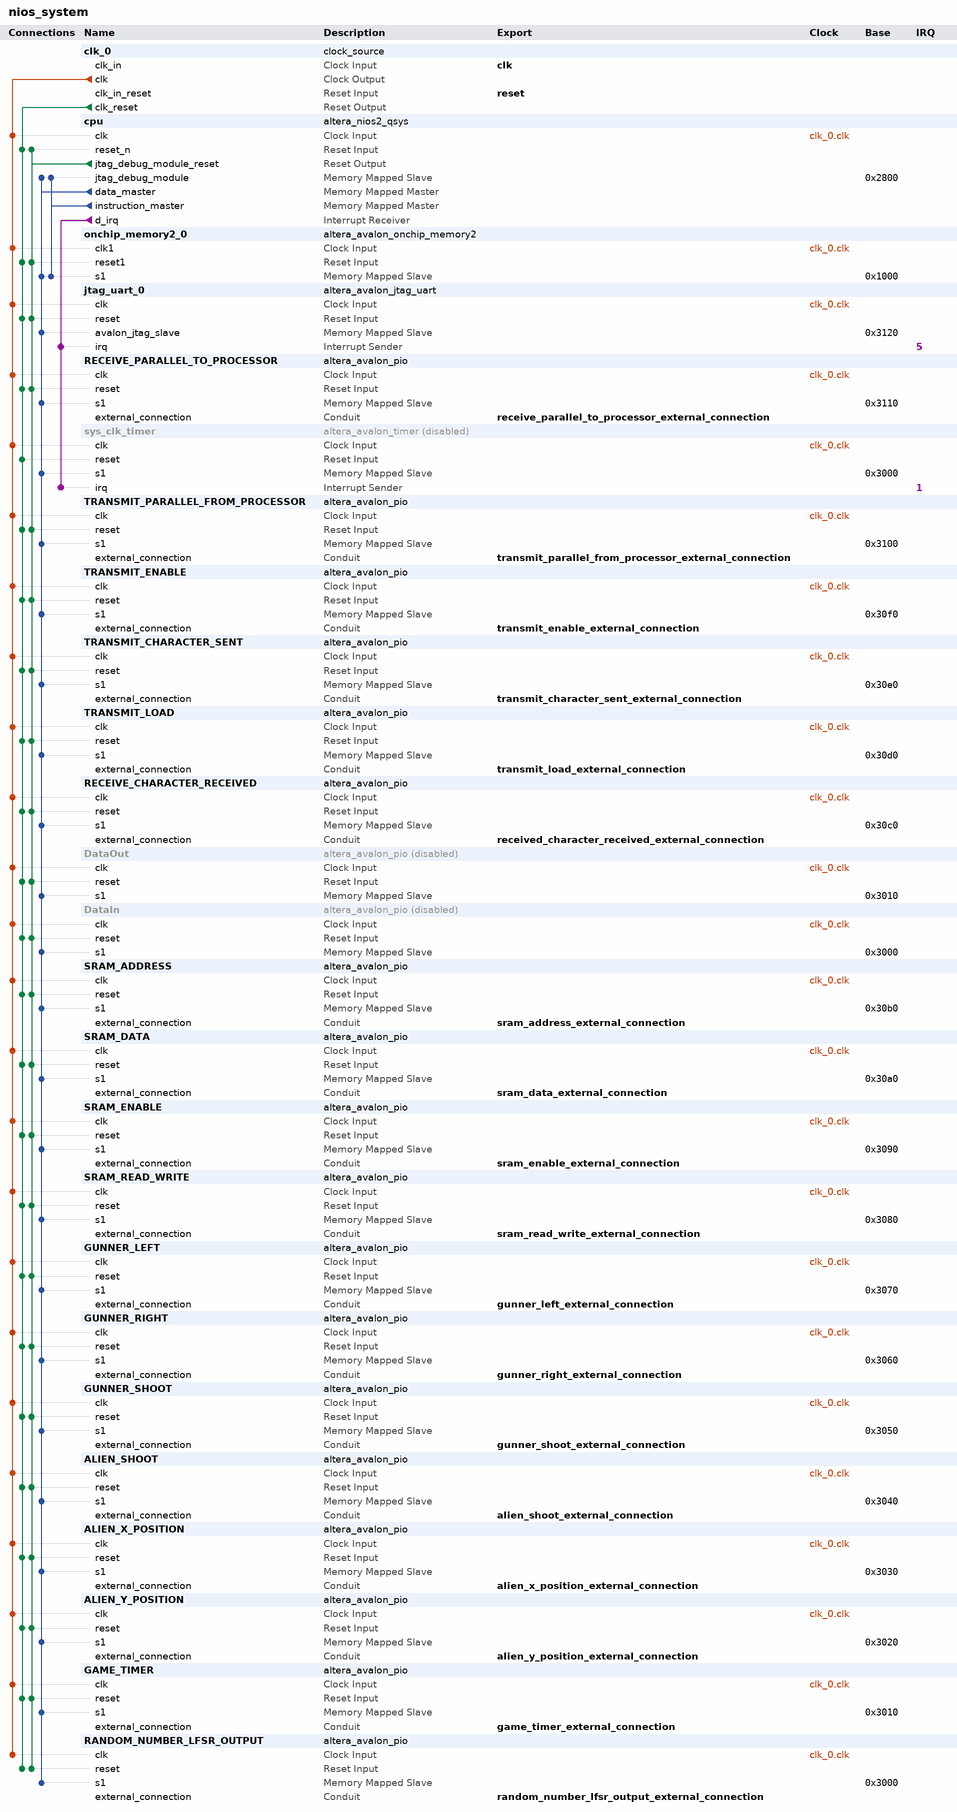
[diagram p0: system contents]
# Platform Designer (Qsys) system nios_system, Cyclone V 5CSEMA5F31C6
# Parameters at their usual value, and those the tool derives, are not listed.
package require -exact qsys 14.0
create_system nios_system
set_project_property DEVICE_FAMILY {Cyclone V}
set_project_property DEVICE 5CSEMA5F31C6

add_instance clk_0 clock_source 14.0
set_instance_parameter_value clk_0 clockFrequency 50000000

add_instance cpu altera_nios2_qsys 14.0
set_instance_parameter_value cpu resetrequest_enabled true
set_instance_parameter_value cpu resetSlave onchip_memory2_0.s1
set_instance_parameter_value cpu mmu_TLBMissExcSlave None
set_instance_parameter_value cpu exceptionSlave onchip_memory2_0.s1
set_instance_parameter_value cpu breakSlave cpu.jtag_debug_module
set_instance_parameter_value cpu impl Tiny
set_instance_parameter_value cpu icache_size 4096

add_instance onchip_memory2_0 altera_avalon_onchip_memory2 14.0
set_instance_parameter_value onchip_memory2_0 dataWidth 32
set_instance_parameter_value onchip_memory2_0 dualPort false
set_instance_parameter_value onchip_memory2_0 initMemContent true
set_instance_parameter_value onchip_memory2_0 initializationFileName onchip_mem.hex
set_instance_parameter_value onchip_memory2_0 memorySize 4096

add_instance jtag_uart_0 altera_avalon_jtag_uart 14.0
set_instance_parameter_value jtag_uart_0 simInteractiveOptions NO_INTERACTIVE_WINDOWS

add_instance RECEIVE_PARALLEL_TO_PROCESSOR altera_avalon_pio 14.0
set_instance_parameter_value RECEIVE_PARALLEL_TO_PROCESSOR direction Input
set_instance_parameter_value RECEIVE_PARALLEL_TO_PROCESSOR width 8

add_instance sys_clk_timer altera_avalon_timer 14.0
set_instance_property sys_clk_timer ENABLED false
set_instance_parameter_value sys_clk_timer period 1
set_instance_parameter_value sys_clk_timer periodUnits MSEC

add_instance TRANSMIT_PARALLEL_FROM_PROCESSOR altera_avalon_pio 14.0
set_instance_parameter_value TRANSMIT_PARALLEL_FROM_PROCESSOR direction Output
set_instance_parameter_value TRANSMIT_PARALLEL_FROM_PROCESSOR width 8

add_instance TRANSMIT_ENABLE altera_avalon_pio 14.0
set_instance_parameter_value TRANSMIT_ENABLE direction Output
set_instance_parameter_value TRANSMIT_ENABLE width 1

add_instance TRANSMIT_CHARACTER_SENT altera_avalon_pio 14.0
set_instance_parameter_value TRANSMIT_CHARACTER_SENT direction Input
set_instance_parameter_value TRANSMIT_CHARACTER_SENT width 1

add_instance TRANSMIT_LOAD altera_avalon_pio 14.0
set_instance_parameter_value TRANSMIT_LOAD direction Output
set_instance_parameter_value TRANSMIT_LOAD width 1

add_instance RECEIVE_CHARACTER_RECEIVED altera_avalon_pio 14.0
set_instance_parameter_value RECEIVE_CHARACTER_RECEIVED direction Input
set_instance_parameter_value RECEIVE_CHARACTER_RECEIVED width 1

add_instance DataOut altera_avalon_pio 14.0
set_instance_property DataOut ENABLED false
set_instance_parameter_value DataOut direction Output
set_instance_parameter_value DataOut width 1

add_instance DataIn altera_avalon_pio 14.0
set_instance_property DataIn ENABLED false
set_instance_parameter_value DataIn direction Input
set_instance_parameter_value DataIn width 1

add_instance SRAM_ADDRESS altera_avalon_pio 14.0
set_instance_parameter_value SRAM_ADDRESS direction Output
set_instance_parameter_value SRAM_ADDRESS width 11

add_instance SRAM_DATA altera_avalon_pio 14.0
set_instance_parameter_value SRAM_DATA direction Bidir
set_instance_parameter_value SRAM_DATA width 8

add_instance SRAM_ENABLE altera_avalon_pio 14.0
set_instance_parameter_value SRAM_ENABLE direction Output
set_instance_parameter_value SRAM_ENABLE width 1

add_instance SRAM_READ_WRITE altera_avalon_pio 14.0
set_instance_parameter_value SRAM_READ_WRITE direction Output
set_instance_parameter_value SRAM_READ_WRITE width 1

add_instance GUNNER_LEFT altera_avalon_pio 14.0
set_instance_parameter_value GUNNER_LEFT direction Input
set_instance_parameter_value GUNNER_LEFT width 1

add_instance GUNNER_RIGHT altera_avalon_pio 14.0
set_instance_parameter_value GUNNER_RIGHT direction Input
set_instance_parameter_value GUNNER_RIGHT width 1

add_instance GUNNER_SHOOT altera_avalon_pio 14.0
set_instance_parameter_value GUNNER_SHOOT direction Input
set_instance_parameter_value GUNNER_SHOOT width 2

add_instance ALIEN_SHOOT altera_avalon_pio 14.0
set_instance_parameter_value ALIEN_SHOOT direction Input
set_instance_parameter_value ALIEN_SHOOT width 1

add_instance ALIEN_X_POSITION altera_avalon_pio 14.0
set_instance_parameter_value ALIEN_X_POSITION direction Input
set_instance_parameter_value ALIEN_X_POSITION width 3

add_instance ALIEN_Y_POSITION altera_avalon_pio 14.0
set_instance_parameter_value ALIEN_Y_POSITION direction Input
set_instance_parameter_value ALIEN_Y_POSITION width 2

add_instance GAME_TIMER altera_avalon_pio 14.0
set_instance_parameter_value GAME_TIMER direction Input
set_instance_parameter_value GAME_TIMER width 32

add_instance RANDOM_NUMBER_LFSR_OUTPUT altera_avalon_pio 14.0
set_instance_parameter_value RANDOM_NUMBER_LFSR_OUTPUT direction Input
set_instance_parameter_value RANDOM_NUMBER_LFSR_OUTPUT width 16

# connections
add_connection clk_0.clk ALIEN_SHOOT.clk clock
add_connection clk_0.clk ALIEN_X_POSITION.clk clock
add_connection clk_0.clk ALIEN_Y_POSITION.clk clock
add_connection clk_0.clk cpu.clk clock
add_connection clk_0.clk DataIn.clk clock
add_connection clk_0.clk DataOut.clk clock
add_connection clk_0.clk GAME_TIMER.clk clock
add_connection clk_0.clk GUNNER_LEFT.clk clock
add_connection clk_0.clk GUNNER_RIGHT.clk clock
add_connection clk_0.clk GUNNER_SHOOT.clk clock
add_connection clk_0.clk jtag_uart_0.clk clock
add_connection clk_0.clk onchip_memory2_0.clk1 clock
add_connection clk_0.clk RANDOM_NUMBER_LFSR_OUTPUT.clk clock
add_connection clk_0.clk RECEIVE_CHARACTER_RECEIVED.clk clock
add_connection clk_0.clk RECEIVE_PARALLEL_TO_PROCESSOR.clk clock
add_connection clk_0.clk SRAM_ADDRESS.clk clock
add_connection clk_0.clk SRAM_DATA.clk clock
add_connection clk_0.clk SRAM_ENABLE.clk clock
add_connection clk_0.clk SRAM_READ_WRITE.clk clock
add_connection clk_0.clk sys_clk_timer.clk clock
add_connection clk_0.clk TRANSMIT_CHARACTER_SENT.clk clock
add_connection clk_0.clk TRANSMIT_ENABLE.clk clock
add_connection clk_0.clk TRANSMIT_LOAD.clk clock
add_connection clk_0.clk TRANSMIT_PARALLEL_FROM_PROCESSOR.clk clock
add_connection clk_0.clk_reset ALIEN_SHOOT.reset reset
add_connection clk_0.clk_reset ALIEN_X_POSITION.reset reset
add_connection clk_0.clk_reset ALIEN_Y_POSITION.reset reset
add_connection clk_0.clk_reset cpu.reset_n reset
add_connection clk_0.clk_reset DataIn.reset reset
add_connection clk_0.clk_reset DataOut.reset reset
add_connection clk_0.clk_reset GAME_TIMER.reset reset
add_connection clk_0.clk_reset GUNNER_LEFT.reset reset
add_connection clk_0.clk_reset GUNNER_RIGHT.reset reset
add_connection clk_0.clk_reset GUNNER_SHOOT.reset reset
add_connection clk_0.clk_reset jtag_uart_0.reset reset
add_connection clk_0.clk_reset onchip_memory2_0.reset1 reset
add_connection clk_0.clk_reset RANDOM_NUMBER_LFSR_OUTPUT.reset reset
add_connection clk_0.clk_reset RECEIVE_CHARACTER_RECEIVED.reset reset
add_connection clk_0.clk_reset RECEIVE_PARALLEL_TO_PROCESSOR.reset reset
add_connection clk_0.clk_reset SRAM_ADDRESS.reset reset
add_connection clk_0.clk_reset SRAM_DATA.reset reset
add_connection clk_0.clk_reset SRAM_ENABLE.reset reset
add_connection clk_0.clk_reset SRAM_READ_WRITE.reset reset
add_connection clk_0.clk_reset sys_clk_timer.reset reset
add_connection clk_0.clk_reset TRANSMIT_CHARACTER_SENT.reset reset
add_connection clk_0.clk_reset TRANSMIT_ENABLE.reset reset
add_connection clk_0.clk_reset TRANSMIT_LOAD.reset reset
add_connection clk_0.clk_reset TRANSMIT_PARALLEL_FROM_PROCESSOR.reset reset
add_connection cpu.jtag_debug_module_reset ALIEN_SHOOT.reset reset
add_connection cpu.jtag_debug_module_reset ALIEN_X_POSITION.reset reset
add_connection cpu.jtag_debug_module_reset ALIEN_Y_POSITION.reset reset
add_connection cpu.jtag_debug_module_reset cpu.reset_n reset
add_connection cpu.jtag_debug_module_reset DataIn.reset reset
add_connection cpu.jtag_debug_module_reset DataOut.reset reset
add_connection cpu.jtag_debug_module_reset GAME_TIMER.reset reset
add_connection cpu.jtag_debug_module_reset GUNNER_LEFT.reset reset
add_connection cpu.jtag_debug_module_reset GUNNER_RIGHT.reset reset
add_connection cpu.jtag_debug_module_reset GUNNER_SHOOT.reset reset
add_connection cpu.jtag_debug_module_reset jtag_uart_0.reset reset
add_connection cpu.jtag_debug_module_reset onchip_memory2_0.reset1 reset
add_connection cpu.jtag_debug_module_reset RANDOM_NUMBER_LFSR_OUTPUT.reset reset
add_connection cpu.jtag_debug_module_reset RECEIVE_CHARACTER_RECEIVED.reset reset
add_connection cpu.jtag_debug_module_reset RECEIVE_PARALLEL_TO_PROCESSOR.reset reset
add_connection cpu.jtag_debug_module_reset SRAM_ADDRESS.reset reset
add_connection cpu.jtag_debug_module_reset SRAM_DATA.reset reset
add_connection cpu.jtag_debug_module_reset SRAM_ENABLE.reset reset
add_connection cpu.jtag_debug_module_reset SRAM_READ_WRITE.reset reset
add_connection cpu.jtag_debug_module_reset TRANSMIT_CHARACTER_SENT.reset reset
add_connection cpu.jtag_debug_module_reset TRANSMIT_ENABLE.reset reset
add_connection cpu.jtag_debug_module_reset TRANSMIT_LOAD.reset reset
add_connection cpu.jtag_debug_module_reset TRANSMIT_PARALLEL_FROM_PROCESSOR.reset reset
add_connection cpu.data_master ALIEN_SHOOT.s1 avalon
set_connection_parameter_value cpu.data_master/ALIEN_SHOOT.s1 baseAddress 0x3040
add_connection cpu.data_master ALIEN_X_POSITION.s1 avalon
set_connection_parameter_value cpu.data_master/ALIEN_X_POSITION.s1 baseAddress 0x3030
add_connection cpu.data_master ALIEN_Y_POSITION.s1 avalon
set_connection_parameter_value cpu.data_master/ALIEN_Y_POSITION.s1 baseAddress 0x3020
add_connection cpu.data_master cpu.jtag_debug_module avalon
set_connection_parameter_value cpu.data_master/cpu.jtag_debug_module baseAddress 0x2800
add_connection cpu.data_master DataIn.s1 avalon
set_connection_parameter_value cpu.data_master/DataIn.s1 baseAddress 0x3000
add_connection cpu.data_master DataOut.s1 avalon
set_connection_parameter_value cpu.data_master/DataOut.s1 baseAddress 0x3010
add_connection cpu.data_master GAME_TIMER.s1 avalon
set_connection_parameter_value cpu.data_master/GAME_TIMER.s1 baseAddress 0x3010
add_connection cpu.data_master GUNNER_LEFT.s1 avalon
set_connection_parameter_value cpu.data_master/GUNNER_LEFT.s1 baseAddress 0x3070
add_connection cpu.data_master GUNNER_RIGHT.s1 avalon
set_connection_parameter_value cpu.data_master/GUNNER_RIGHT.s1 baseAddress 0x3060
add_connection cpu.data_master GUNNER_SHOOT.s1 avalon
set_connection_parameter_value cpu.data_master/GUNNER_SHOOT.s1 baseAddress 0x3050
add_connection cpu.data_master jtag_uart_0.avalon_jtag_slave avalon
set_connection_parameter_value cpu.data_master/jtag_uart_0.avalon_jtag_slave baseAddress 0x3120
add_connection cpu.data_master onchip_memory2_0.s1 avalon
set_connection_parameter_value cpu.data_master/onchip_memory2_0.s1 baseAddress 0x1000
add_connection cpu.data_master RANDOM_NUMBER_LFSR_OUTPUT.s1 avalon
set_connection_parameter_value cpu.data_master/RANDOM_NUMBER_LFSR_OUTPUT.s1 baseAddress 0x3000
add_connection cpu.data_master RECEIVE_CHARACTER_RECEIVED.s1 avalon
set_connection_parameter_value cpu.data_master/RECEIVE_CHARACTER_RECEIVED.s1 baseAddress 0x30c0
add_connection cpu.data_master RECEIVE_PARALLEL_TO_PROCESSOR.s1 avalon
set_connection_parameter_value cpu.data_master/RECEIVE_PARALLEL_TO_PROCESSOR.s1 baseAddress 0x3110
add_connection cpu.data_master SRAM_ADDRESS.s1 avalon
set_connection_parameter_value cpu.data_master/SRAM_ADDRESS.s1 baseAddress 0x30b0
add_connection cpu.data_master SRAM_DATA.s1 avalon
set_connection_parameter_value cpu.data_master/SRAM_DATA.s1 baseAddress 0x30a0
add_connection cpu.data_master SRAM_ENABLE.s1 avalon
set_connection_parameter_value cpu.data_master/SRAM_ENABLE.s1 baseAddress 0x3090
add_connection cpu.data_master SRAM_READ_WRITE.s1 avalon
set_connection_parameter_value cpu.data_master/SRAM_READ_WRITE.s1 baseAddress 0x3080
add_connection cpu.data_master sys_clk_timer.s1 avalon
set_connection_parameter_value cpu.data_master/sys_clk_timer.s1 baseAddress 0x3000
add_connection cpu.data_master TRANSMIT_CHARACTER_SENT.s1 avalon
set_connection_parameter_value cpu.data_master/TRANSMIT_CHARACTER_SENT.s1 baseAddress 0x30e0
add_connection cpu.data_master TRANSMIT_ENABLE.s1 avalon
set_connection_parameter_value cpu.data_master/TRANSMIT_ENABLE.s1 baseAddress 0x30f0
add_connection cpu.data_master TRANSMIT_LOAD.s1 avalon
set_connection_parameter_value cpu.data_master/TRANSMIT_LOAD.s1 baseAddress 0x30d0
add_connection cpu.data_master TRANSMIT_PARALLEL_FROM_PROCESSOR.s1 avalon
set_connection_parameter_value cpu.data_master/TRANSMIT_PARALLEL_FROM_PROCESSOR.s1 baseAddress 0x3100
add_connection cpu.instruction_master cpu.jtag_debug_module avalon
set_connection_parameter_value cpu.instruction_master/cpu.jtag_debug_module baseAddress 0x2800
add_connection cpu.instruction_master onchip_memory2_0.s1 avalon
set_connection_parameter_value cpu.instruction_master/onchip_memory2_0.s1 baseAddress 0x1000
add_connection cpu.d_irq jtag_uart_0.irq interrupt
set_connection_parameter_value cpu.d_irq/jtag_uart_0.irq irqNumber 5
add_connection cpu.d_irq sys_clk_timer.irq interrupt
set_connection_parameter_value cpu.d_irq/sys_clk_timer.irq irqNumber 1

# exported interfaces
add_interface reset reset sink
set_interface_property reset EXPORT_OF clk_0.clk_in_reset
add_interface receive_parallel_to_processor_external_connection conduit end
set_interface_property receive_parallel_to_processor_external_connection EXPORT_OF RECEIVE_PARALLEL_TO_PROCESSOR.external_connection
add_interface clk clock sink
set_interface_property clk EXPORT_OF clk_0.clk_in
add_interface transmit_parallel_from_processor_external_connection conduit end
set_interface_property transmit_parallel_from_processor_external_connection EXPORT_OF TRANSMIT_PARALLEL_FROM_PROCESSOR.external_connection
add_interface transmit_enable_external_connection conduit end
set_interface_property transmit_enable_external_connection EXPORT_OF TRANSMIT_ENABLE.external_connection
add_interface transmit_character_sent_external_connection conduit end
set_interface_property transmit_character_sent_external_connection EXPORT_OF TRANSMIT_CHARACTER_SENT.external_connection
add_interface transmit_load_external_connection conduit end
set_interface_property transmit_load_external_connection EXPORT_OF TRANSMIT_LOAD.external_connection
add_interface received_character_received_external_connection conduit end
set_interface_property received_character_received_external_connection EXPORT_OF RECEIVE_CHARACTER_RECEIVED.external_connection
add_interface sram_address_external_connection conduit end
set_interface_property sram_address_external_connection EXPORT_OF SRAM_ADDRESS.external_connection
add_interface sram_data_external_connection conduit end
set_interface_property sram_data_external_connection EXPORT_OF SRAM_DATA.external_connection
add_interface sram_enable_external_connection conduit end
set_interface_property sram_enable_external_connection EXPORT_OF SRAM_ENABLE.external_connection
add_interface sram_read_write_external_connection conduit end
set_interface_property sram_read_write_external_connection EXPORT_OF SRAM_READ_WRITE.external_connection
add_interface gunner_left_external_connection conduit end
set_interface_property gunner_left_external_connection EXPORT_OF GUNNER_LEFT.external_connection
add_interface gunner_right_external_connection conduit end
set_interface_property gunner_right_external_connection EXPORT_OF GUNNER_RIGHT.external_connection
add_interface gunner_shoot_external_connection conduit end
set_interface_property gunner_shoot_external_connection EXPORT_OF GUNNER_SHOOT.external_connection
add_interface alien_shoot_external_connection conduit end
set_interface_property alien_shoot_external_connection EXPORT_OF ALIEN_SHOOT.external_connection
add_interface alien_x_position_external_connection conduit end
set_interface_property alien_x_position_external_connection EXPORT_OF ALIEN_X_POSITION.external_connection
add_interface alien_y_position_external_connection conduit end
set_interface_property alien_y_position_external_connection EXPORT_OF ALIEN_Y_POSITION.external_connection
add_interface game_timer_external_connection conduit end
set_interface_property game_timer_external_connection EXPORT_OF GAME_TIMER.external_connection
add_interface random_number_lfsr_output_external_connection conduit end
set_interface_property random_number_lfsr_output_external_connection EXPORT_OF RANDOM_NUMBER_LFSR_OUTPUT.external_connection

set_interconnect_requirement {$system} qsys_mm.clockCrossingAdapter HANDSHAKE
set_interconnect_requirement {$system} qsys_mm.maxAdditionalLatency 1
set_interconnect_requirement {$system} qsys_mm.insertDefaultSlave FALSE

save_system nios_system.qsys
